# Altium project CarteCapteurAvant3.PrjPcb
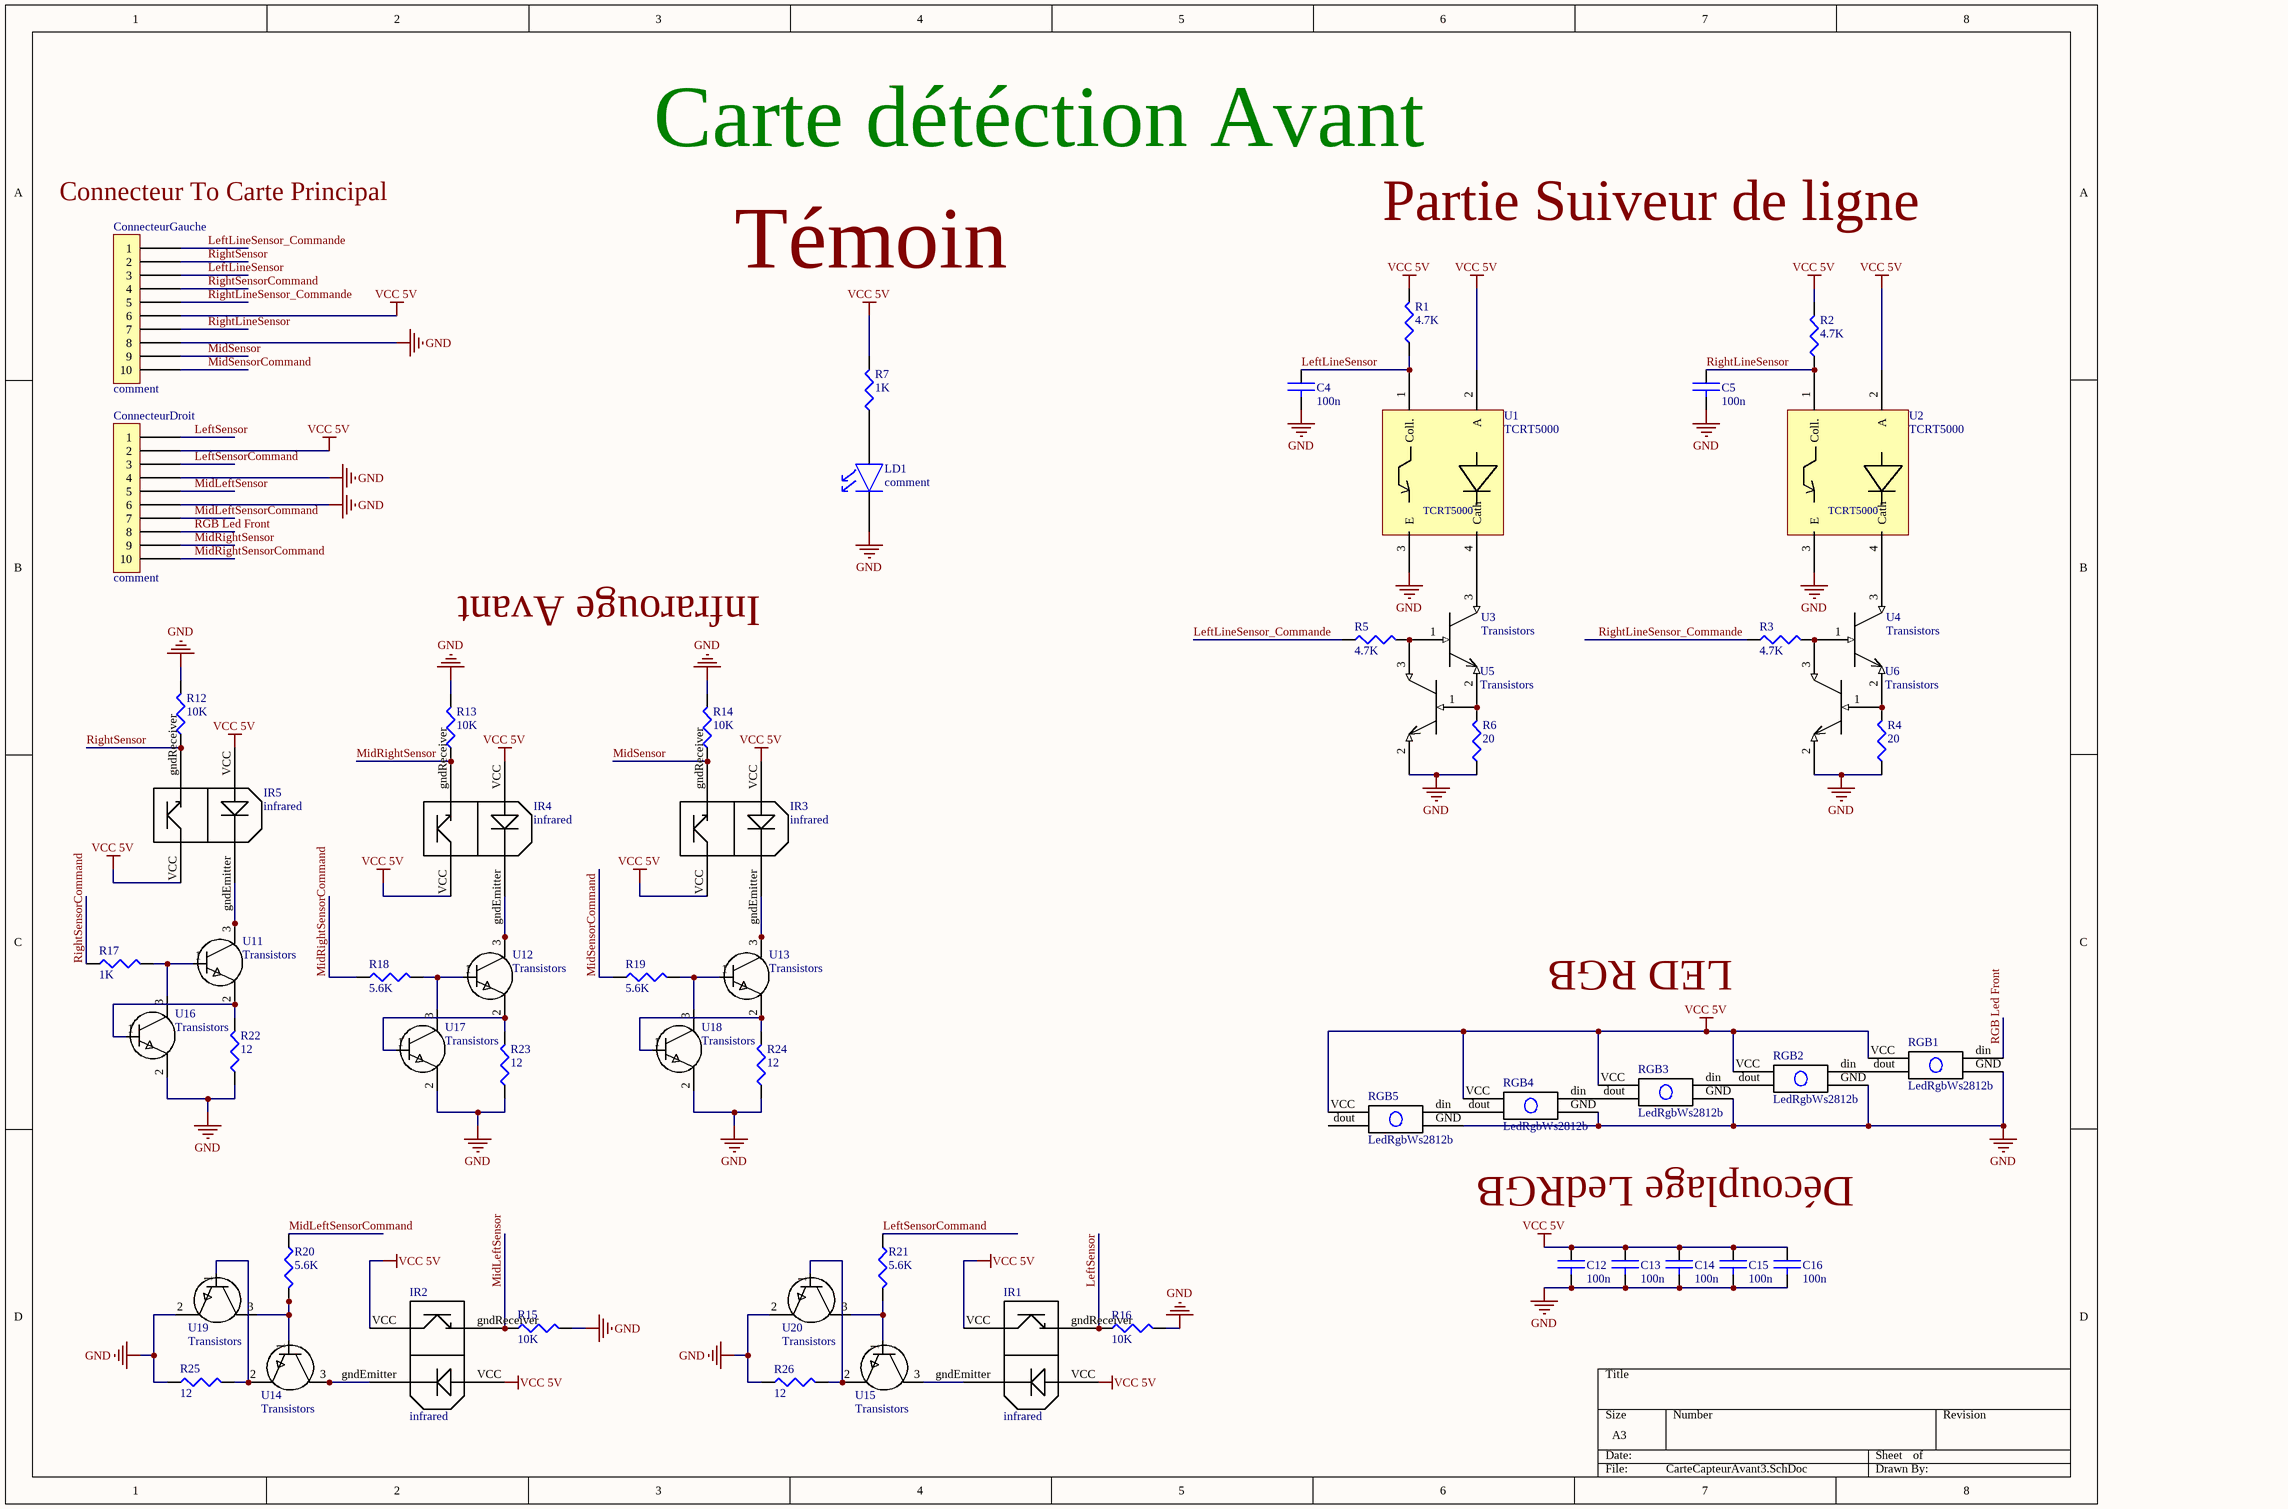
[diagram p0: CarteCapteurAvant3.SchDoc]
1 sheet, 58 parts. Net scope: global (net labels, ports and power ports of the same name join across sheets).
Board file: CarteCapteurAvant3.PCBDOC

## Sheet CarteCapteurAvant3.SchDoc
size A3

### Parts
C4  value 100n  [0805]  (hidden comment: CAP)
C5  value 100n  [0805]  (hidden comment: CAP)
C12  value 100n  [0805]  (hidden comment: CAP)
C13  value 100n  [0805]  (hidden comment: CAP)
C14  value 100n  [0805]  (hidden comment: CAP)
C15  value 100n  [0805]  (hidden comment: CAP)
C16  value 100n  [0805]  (hidden comment: CAP)
ConnecteurDroit  comment  [HE10-10V]
ConnecteurGauche  comment  [HE10-10V]
IR1  infrared  [Infrared]
IR2  infrared  [Infrared]
IR3  infrared  [Infrared]
IR4  infrared  [Infrared]
IR5  infrared  [Infrared]
LD1  comment  [LED1206]
R1  value 4.7K  [0805]  (hidden comment: RES)
R2  value 4.7K  [0805]  (hidden comment: RES)
R3  value 4.7K  [0805]  (hidden comment: RES)
R4  value 20  [0805]  (hidden comment: RES)
R5  value 4.7K  [0805]  (hidden comment: RES)
R6  value 20  [0805]  (hidden comment: RES)
R7  value 1K  [0805]  (hidden comment: RES)
R12  value 10K  [0805]  (hidden comment: RES)
R13  value 10K  [0805]  (hidden comment: RES)
R14  value 10K  [0805]  (hidden comment: RES)
R15  value 10K  [0805]  (hidden comment: RES)
R16  value 10K  [0805]  (hidden comment: RES)
R17  value 1K  [0805]  (hidden comment: RES)
R18  value 5.6K  [0805]  (hidden comment: RES)
R19  value 5.6K  [0805]  (hidden comment: RES)
R20  value 5.6K  [0805]  (hidden comment: RES)
R21  value 5.6K  [0805]  (hidden comment: RES)
R22  value 12  [0805]  (hidden comment: RES)
R23  value 12  [0805]  (hidden comment: RES)
R24  value 12  [0805]  (hidden comment: RES)
R25  value 12  [0805]  (hidden comment: RES)
R26  value 12  [0805]  (hidden comment: RES)
RGB1  LedRgbWs2812b  [LedRgbWs2812b]
RGB2  LedRgbWs2812b  [LedRgbWs2812b]
RGB3  LedRgbWs2812b  [LedRgbWs2812b]
RGB4  LedRgbWs2812b  [LedRgbWs2812b]
RGB5  LedRgbWs2812b  [LedRgbWs2812b]
U1  TCRT5000  [TCRT5000 Droit]
U2  TCRT5000  [TCRT5000 Droit]
U3  Transistors  [BC817-40]
U4  Transistors  [BC817-40]
U5  Transistors  [BC817-40]
U6  Transistors  [BC817-40]
U11  Transistors  [BC817-40]
U12  Transistors  [BC817-40]
U13  Transistors  [BC817-40]
U14  Transistors  [BC817-40]
U15  Transistors  [BC817-40]
U16  Transistors  [BC817-40]
U17  Transistors  [BC817-40]
U18  Transistors  [BC817-40]
U19  Transistors  [BC817-40]
U20  Transistors  [BC817-40]

### Nets
GND: C4.2 C5.2 C12.2 C13.2 C14.2 C15.2 C16.2 ConnecteurDroit.4 ConnecteurDroit.6 ConnecteurGauche.8 LD1.K R4.1 R6.1 R12.2 R13.2 R14.2 R15.2 R16.2 R22.1 R23.1 R24.1 R25.1 R26.1 RGB1.GND RGB2.GND RGB3.GND RGB4.GND RGB5.GND U1.3(E) U2.3(E) U5.2(Emiter) U6.2(Emiter) U16.2(Emi) U17.2(Emi) U18.2(Emi) U19.2(Emi) U20.2(Emi)
VCC 5V: C12.1 C13.1 C14.1 C15.1 C16.1 ConnecteurDroit.2 ConnecteurGauche.6 IR1.VCC IR2.VCC IR3.VCC IR4.VCC IR5.VCC R1.2 R2.2 R7.2 RGB1.VCC RGB2.VCC RGB3.VCC RGB4.VCC RGB5.VCC U1.2(A) U2.2(A)
LeftLineSensor: C4.1 ConnecteurGauche.3 R1.1 U1.1(Coll.)
LeftLineSensor_Commande: ConnecteurGauche.1 R5.1
LeftSensor: ConnecteurDroit.1 IR1.gndReceiver R16.1
LeftSensorCommand: ConnecteurDroit.3 R21.1
MidLeftSensor: ConnecteurDroit.5 IR2.gndReceiver R15.1
MidLeftSensorCommand: ConnecteurDroit.7 R20.1
MidRightSensor: ConnecteurDroit.9 IR4.gndReceiver R13.1
MidRightSensorCommand: ConnecteurDroit.10 R18.1
MidSensor: ConnecteurGauche.9 IR3.gndReceiver R14.1
MidSensorCommand: ConnecteurGauche.10 R19.1
RGB Led Front: ConnecteurDroit.8 RGB1.din
RightLineSensor: C5.1 ConnecteurGauche.7 R2.1 U2.1(Coll.)
RightLineSensor_Commande: ConnecteurGauche.5 R3.1
RightSensor: ConnecteurGauche.2 IR5.gndReceiver R12.1
RightSensorCommand: ConnecteurGauche.4 R17.1
NetIR1_gndEmitter: IR1.gndEmitter U15.3(Co)
NetIR2_gndEmitter: IR2.gndEmitter U14.3(Co)
NetIR3_gndEmitter: IR3.gndEmitter U13.3(Co)
NetIR4_gndEmitter: IR4.gndEmitter U12.3(Co)
NetIR5_gndEmitter: IR5.gndEmitter U11.3(Co)
NetLD1_A: LD1.A R7.1
NetR3_2: R3.2 U4.1(Base) U6.3(Collector)
NetR4_2: R4.2 U4.2(Emiter) U6.1(Base)
NetR5_2: R5.2 U3.1(Base) U5.3(Collector)
NetR6_2: R6.2 U3.2(Emiter) U5.1(Base)
NetR17_2: R17.2 U11.1(Base) U16.3(Co)
NetR18_2: R18.2 U12.1(Base) U17.3(Co)
NetR19_2: R19.2 U13.1(Base) U18.3(Co)
NetR20_2: R20.2 U14.1(Base) U19.3(Co)
NetR21_2: R21.2 U15.1(Base) U20.3(Co)
NetR22_2: R22.2 U11.2(Emi) U16.1(Base)
NetR23_2: R23.2 U12.2(Emi) U17.1(Base)
NetR24_2: R24.2 U13.2(Emi) U18.1(Base)
NetR25_2: R25.2 U14.2(Emi) U19.1(Base)
NetR26_2: R26.2 U15.2(Emi) U20.1(Base)
NetRGB1_dout: RGB1.dout RGB2.din
NetRGB2_dout: RGB2.dout RGB3.din
NetRGB3_dout: RGB3.dout RGB4.din
NetRGB4_dout: RGB4.dout RGB5.din
NetU1_4: U1.4(Cath) U3.3(Collector)
NetU2_4: U2.4(Cath) U4.3(Collector)

Not connected (* = marked no-connect by the designer): RGB5 dout

### Notes on the sheet
- Carte détéction Avant
- (near ConnecteurGauche) Connecteur To Carte Principal
- Partie Suiveur de ligne
- Témoin
- Infrarouge Avant
- LED RGB
- Découplage LedRGB

### Library data of the parts
C4 C5 C12-C16 = CAP: capacité non polarisée
ConnecteurDroit ConnecteurGauche = HE10-10: 10-pin connector
IR1-IR5 = RPR-359F
LD1 = LED: LED 5mm/3mm/CMS
R1-R7 R12-R26 = RES: resistance
U11-U20 = Transistors: NPN transistor